# EAGLE design Trigger Chameleon (EAGLE 8.1.1)
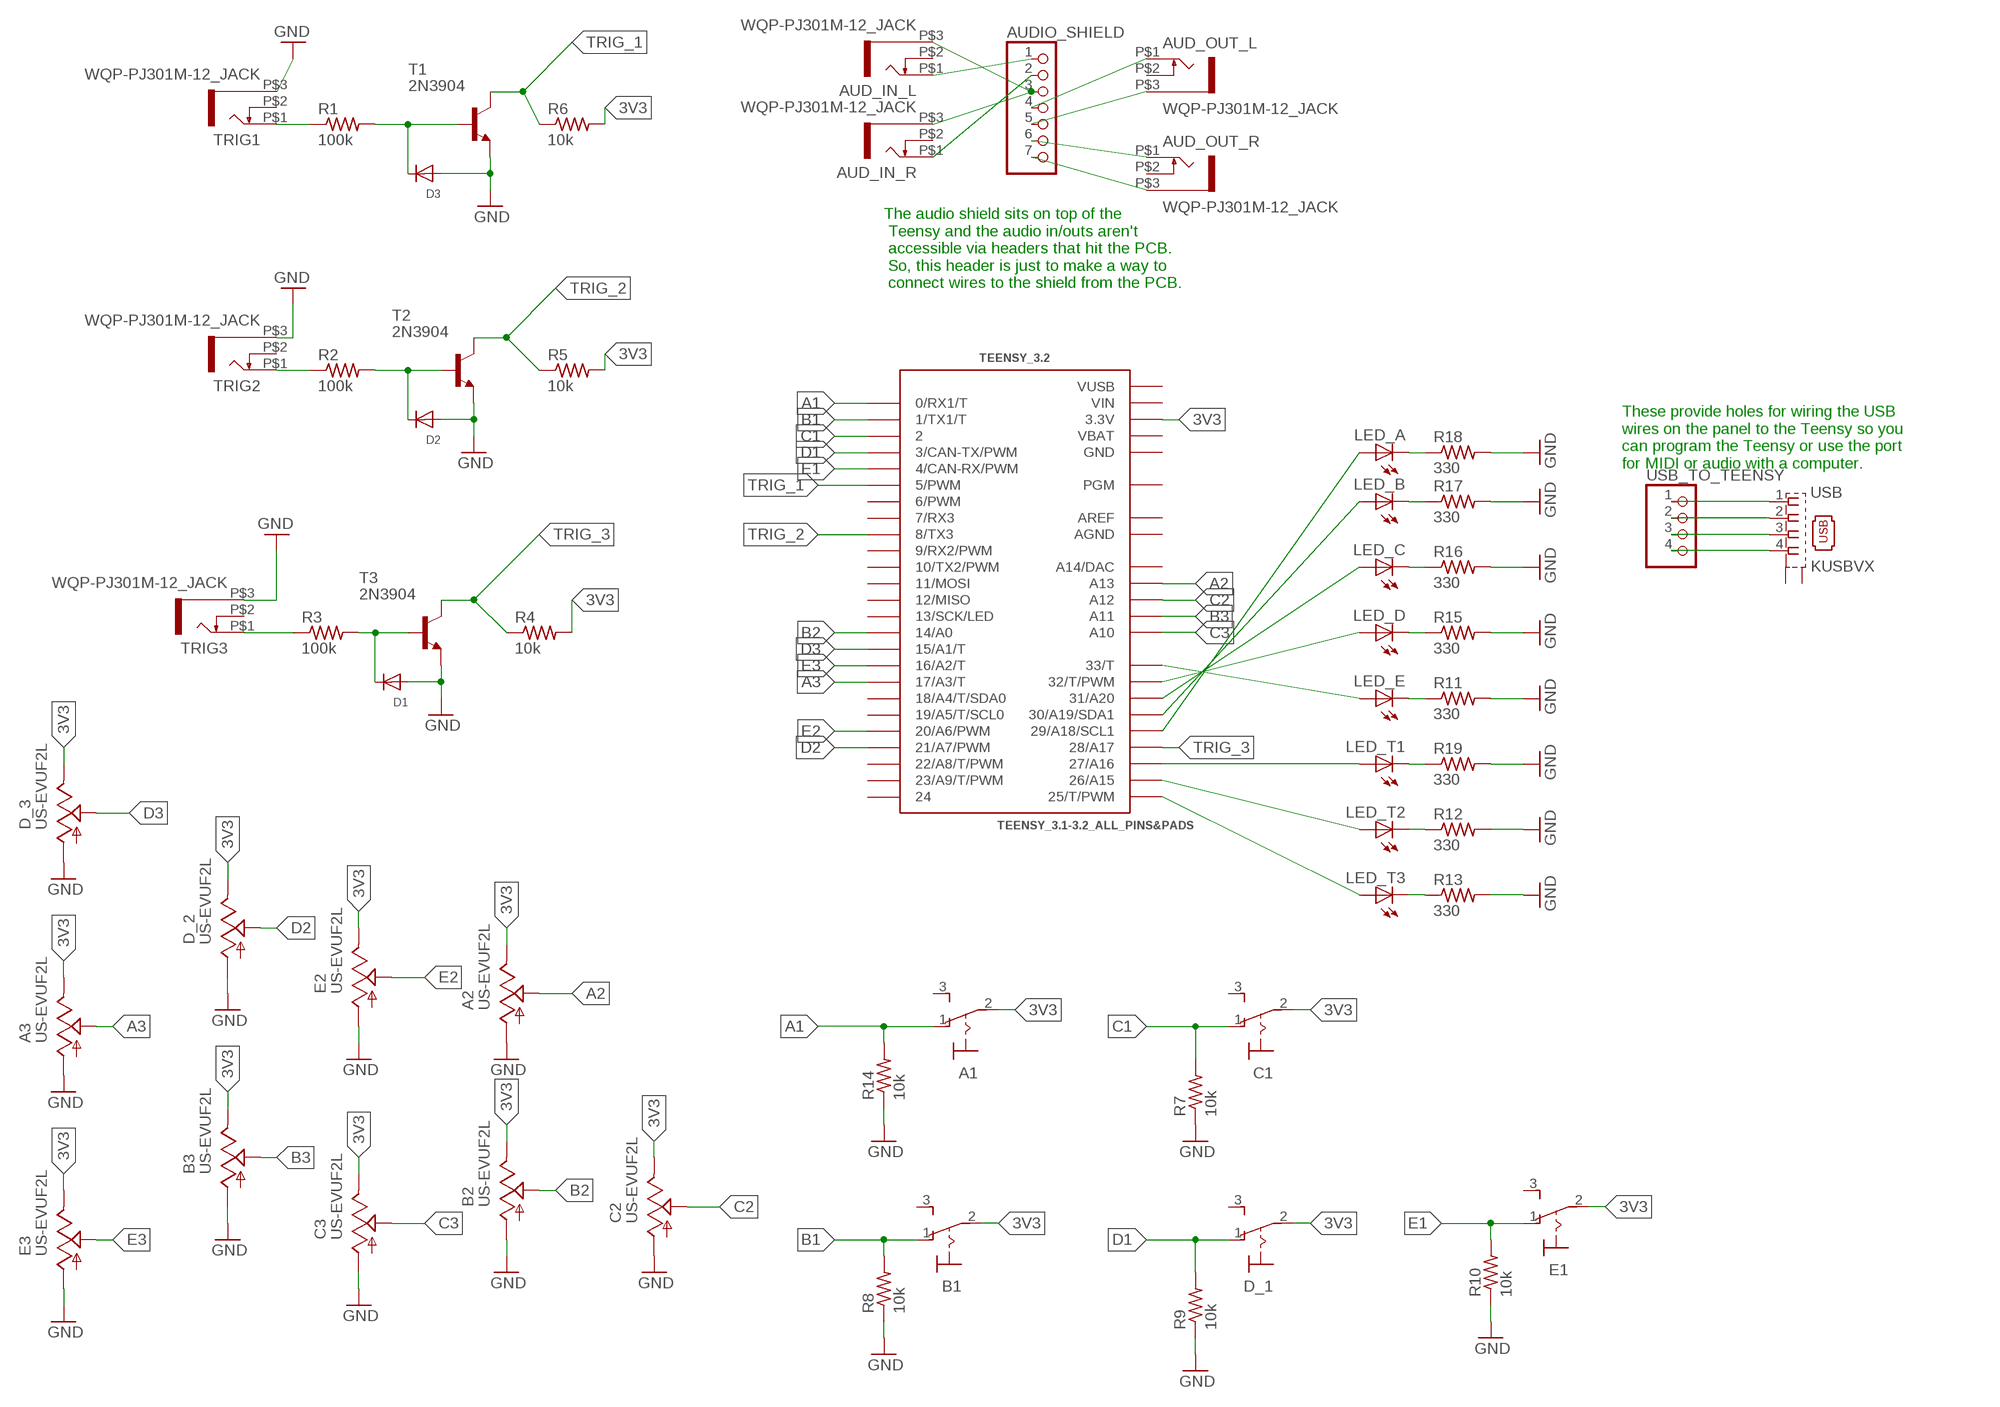
[diagram p0: schematic, sheet 1]

## Parts
A1  M9040P  [M9040P]
A2  US-EVUF2L  [EVUFXL]
A3  US-EVUF2L  [EVUFXL]
AUD_IN_L  WQP-PJ301M-12_JACK  [WQP-PJ301M-12_JACK]
AUD_IN_R  WQP-PJ301M-12_JACK  [WQP-PJ301M-12_JACK]
AUD_OUT_L  WQP-PJ301M-12_JACK  [WQP-PJ301M-12_JACK]
AUD_OUT_R  WQP-PJ301M-12_JACK  [WQP-PJ301M-12_JACK]
AUDIO_SHIELD  PINHD-1X7  [1X07]
B1  M9040P  [M9040P]
B2  US-EVUF2L  [EVUFXL]
B3  US-EVUF2L  [EVUFXL]
C1  M9040P  [M9040P]
C2  US-EVUF2L  [EVUFXL]
C3  US-EVUF2L  [EVUFXL]
D1  DIODESOD-123  [SOD-123]
D2  DIODESOD-123  [SOD-123]
D3  DIODESOD-123  [SOD-123]
D_1  M9040P  [M9040P]
D_2  US-EVUF2L  [EVUFXL]
D_3  US-EVUF2L  [EVUFXL]
E1  M9040P  [M9040P]
E2  US-EVUF2L  [EVUFXL]
E3  US-EVUF2L  [EVUFXL]
LED_A  LED3MM  [LED3MM]
LED_B  LED3MM  [LED3MM]
LED_C  LED3MM  [LED3MM]
LED_D  LED3MM  [LED3MM]
LED_E  LED3MM  [LED3MM]
LED_T1  LED3MM  [LED3MM]
LED_T2  LED3MM  [LED3MM]
LED_T3  LED3MM  [LED3MM]
R1  100k  R-US_R0805  [R0805]
R2  100k  R-US_R0805  [R0805]
R3  100k  R-US_R0805  [R0805]
R4  10k  R-US_R0805  [R0805]
R5  10k  R-US_R0805  [R0805]
R6  10k  R-US_R0805  [R0805]
R7  10k  R-US_R0805  [R0805]
R8  10k  R-US_R0805  [R0805]
R9  10k  R-US_R0805  [R0805]
R10  10k  R-US_R0805  [R0805]
R11  330  R-US_R0805  [R0805]
R12  330  R-US_R0805  [R0805]
R13  330  R-US_R0805  [R0805]
R14  10k  R-US_R0805  [R0805]
R15  330  R-US_R0805  [R0805]
R16  330  R-US_R0805  [R0805]
R17  330  R-US_R0805  [R0805]
R18  330  R-US_R0805  [R0805]
R19  330  R-US_R0805  [R0805]
T1  2N3904  [TO92]
T2  2N3904  [TO92]
T3  2N3904  [TO92]
TEENSY_3.2  TEENSY_3.1-3.2_ALL_PINS&PADS  [TEENSY_3.0-3.2_ALL_PINS_&_PADS]
TRIG1  WQP-PJ301M-12_JACK  [WQP-PJ301M-12_JACK]
TRIG2  WQP-PJ301M-12_JACK  [WQP-PJ301M-12_JACK]
TRIG3  WQP-PJ301M-12_JACK  [WQP-PJ301M-12_JACK]
USB  KUSBVX  [KUSBVX]
USB_TO_TEENSY  PINHD-1X4  [1X04]

## Nets
3V3: A1.2(P) A2.3(E) A3.3(E) B1.2(P) B2.3(E) B3.3(E) C1.2(P) C2.3(E) C3.3(E) D_1.2(P) D_2.3(E) D_3.3(E) E1.2(P) E2.3(E) E3.3(E) R4.2 R5.2 R6.2 TEENSY_3.2.3.3V TEENSY_3.2.3.3V1(3.3V) TEENSY_3.2.3.3V2(3.3V)
A1: A1.1(O) R14.2 TEENSY_3.2.0(0/RX1/T)
A2: A2.2(S) TEENSY_3.2.A13
A3: A3.2(S) TEENSY_3.2.17/A3(17/A3/T)
B1: B1.1(O) R8.2 TEENSY_3.2.1(1/TX1/T)
B2: B2.2(S) TEENSY_3.2.14/A0
B3: B3.2(S) TEENSY_3.2.A11
C1: C1.1(O) R7.2 TEENSY_3.2.2
C2: C2.2(S) TEENSY_3.2.A12
C3: C3.2(S) TEENSY_3.2.A10
D1: D_1.1(O) R9.2 TEENSY_3.2.3(3/CAN-TX/PWM)
D2: D_2.2(S) TEENSY_3.2.21/A7(21/A7/PWM)
D3: D_3.2(S) TEENSY_3.2.15/A1(15/A1/T)
E1: E1.1(O) R10.2 TEENSY_3.2.4(4/CAN-RX/PWM)
E2: E2.2(S) TEENSY_3.2.20/A6(20/A6/PWM)
E3: E3.2(S) TEENSY_3.2.16/A2(16/A2/T)
GND: A2.1(A) A3.1(A) B2.1(A) B3.1(A) C2.1(A) C3.1(A) D1.A D2.A D3.A D_2.1(A) D_3.1(A) E3.1(A) R7.1 R8.1 R9.1 R10.1 R11.2 R12.2 R13.2 R14.1 R15.2 R16.2 R17.2 R18.2 R19.2 T1.3(E) T2.3(E) T3.3(E) TRIG1.P$3 TRIG2.P$3 TRIG3.P$3
N$1: R3.1 TRIG3.P$1
N$2: R2.1 TRIG2.P$1
N$3: R1.1 TRIG1.P$1
N$4: D3.C R1.2 T1.2(B)
N$5: D2.C R2.2 T2.2(B)
N$6: D1.C R3.2 T3.2(B)
N$7: LED_D.K(C) R15.1
N$8: LED_C.K(C) R16.1
N$9: LED_B.K(C) R17.1
N$10: LED_A.K(C) R18.1
N$11: LED_E.K(C) R11.1
N$12: LED_T3.K(C) R13.1
N$13: LED_T2.K(C) R12.1
N$14: AUD_IN_L.P$1 AUDIO_SHIELD.1
N$15: AUD_IN_R.P$1 AUDIO_SHIELD.2
N$16: AUD_OUT_R.P$1 AUDIO_SHIELD.6
N$17: AUD_OUT_L.P$1 AUDIO_SHIELD.4
N$18: LED_T1.K(C) R19.1
N$19: LED_A.A TEENSY_3.2.29(29/A18/SCL1)
N$20: LED_B.A TEENSY_3.2.30(30/A19/SDA1)
N$21: LED_C.A TEENSY_3.2.31(31/A20)
N$22: LED_D.A TEENSY_3.2.32(32/T/PWM)
N$23: LED_E.A TEENSY_3.2.33(33/T)
N$28: AUD_OUT_R.P$3 AUDIO_SHIELD.7
N$30: AUD_OUT_L.P$3 AUDIO_SHIELD.5
N$31: AUD_IN_L.P$3 AUD_IN_R.P$3 AUDIO_SHIELD.3
N$32: LED_T1.A TEENSY_3.2.27(27/A16)
N$33: LED_T2.A TEENSY_3.2.26(26/A15)
N$34: LED_T3.A TEENSY_3.2.25(25/T/PWM)
N$38: USB.1 USB_TO_TEENSY.1
N$39: USB.2 USB_TO_TEENSY.2
N$40: USB.3 USB_TO_TEENSY.3
N$41: USB.4 USB_TO_TEENSY.4
TRIG_1: R6.1 T1.1(C) TEENSY_3.2.5(5/PWM)
TRIG_2: R5.1 T2.1(C) TEENSY_3.2.8(8/TX3)
TRIG_3: R4.1 T3.1(C) TEENSY_3.2.28(28/A17)
Unconnected: A1.3(S) AUD_IN_L.P$2 AUD_IN_R.P$2 AUD_OUT_L.P$2 AUD_OUT_R.P$2 B1.3(S) C1.3(S) D_1.3(S) E1.3(S) E2.1(A) TEENSY_3.2.6(6/PWM) TEENSY_3.2.7(7/RX3) TEENSY_3.2.9(9/RX2/PWM) TEENSY_3.2.10(10/TX2/PWM) TEENSY_3.2.11(11/MOSI) TEENSY_3.2.12(12/MISO) TEENSY_3.2.13(13/SCK/LED) TEENSY_3.2.18/A4(18/A4/T/SDA0) TEENSY_3.2.19/A5(19/A5/T/SCL0) TEENSY_3.2.22/A8(22/A8/T/PWM) TEENSY_3.2.23/A9(23/A9/T/PWM) TEENSY_3.2.24 TEENSY_3.2.PGM TEENSY_3.2.RESET/DAC(A14/DAC) TRIG1.P$2 TRIG2.P$2 TRIG3.P$2 USB.M1(S1) USB.M2(S2)

## Notes on the sheet
- The audio shield sits on top of the
   Teensy and the audio in/outs aren't
   accessible via headers that hit the PCB.
   So, this header is just to make a way to
   connect wires to the shield from the PCB.
- These provide holes for wiring the USB
  wires on the panel to the Teensy so you 
  can program the Teensy or use the port
  for MIDI or audio with a computer.

## Power pins joined to a net without a drawn wire
AGND: TEENSY_3.2.AGND
AREF: TEENSY_3.2.AREF
GND: TEENSY_3.2.GND TEENSY_3.2.GND1(GND) TEENSY_3.2.GND2(GND)
VBAT: TEENSY_3.2.VBAT
VIN: TEENSY_3.2.VIN
VUSB: TEENSY_3.2.VUSB

## Library data of the parts
A1 B1 C1 D_1 E1 = switch:M9040P: TOGGLE SWITCH Marquardt
A2 A3 B2 B3 C2 C3 D_2 D_3 E2 E3 = pot:US-EVU: 9 mm Square Rotary Potentiometers Source: Panasonic
AUD_IN_L AUD_IN_R AUD_OUT_L AUD_OUT_R TRIG1-TRIG3 = thonkiconn:WQP-PJ301M-12_JACK
AUDIO_SHIELD = pinhead:PINHD-1X7: PIN HEADER
D1-D3 = adafruit:DIODE: Diode SMADIODE - SMA Surface Mount Package 20V 1A Schottky Diode Digikey: 641-1014-6-ND DO-1N4148 - Through Hole Small Current Diode SOD-123 20V 1 A (.5mV Vf) Schottky Diode - Digikey: MBRX120TPMSCT-ND SOD-323 10V 570mA (.38mV Vf, 3ns) Schottky Diode - Digikey: ZLLS410CT-ND SOD-523 30V 30mA Schottky Diode (RB751S-40TE61) - Digikey: RB751S-40TE61CT-ND SOT23-R/W - SOT23 Package (R = Solder Paste/Reflow Ovens, W = Hand-Soldering) BAT54Film 40V 300mA - Digikey: 497-7162-1-ND
LED_A LED_B LED_C LED_D LED_E LED_T1-LED_T3 = adafruit:LED: LED OSRAM: - CHIPLED LG R971, LG N971, LY N971, LG Q971, LY Q971, LO R971, LY R971 LH N974, LH R974 LS Q976, LO Q976, LY Q976 LO Q996 - Hyper CHIPLED LW Q18S LB Q993, LB Q99A, LB R99A - SideLED LS A670, LO A670, LY A670, LG A670, LP A670 LB A673, LV A673, LT A673, LW A673 LH A674 LY A675 LS A676, LA A676, LO A676, LY A676, LW A676 LS A679, LY A679, LG A679 - Hyper Micro SIDELED® LS Y876, LA Y876, LO Y876, LY Y876 LT Y87S - SmartLED LW L88C, LW L88S LB L89C, LB L89S, LG L890 LS L89K, LO L89K, LY L89K LS L896, LA L896, LO L896, LY L896 - TOPLED LS T670, LO T670, LY T670, LG T670, LP T670 LSG T670, LSP T670, LSY T670, LOP T670, LYG T670 LG T671, LOG T671, LSG T671 LB T673, LV T673, LT T673, LW T673 LH T674 LS T676, LA T676, LO T676, LY T676, LB T676, LH T676, LSB T676, LW T676 LB T67C, LV T67C, LT T67C, LS T67K, LO T67K, LY T67K, LW E67C LS E67B, LA E67B, LO E67B, LY E67B, LB E67C, LV E67C, LT E67C LW T67C LS T679, LY T679, LG T679 LS T770, LO T770, LY T770, LG T770, LP T770 LB T773, LV T773, LT T773, LW T773 LH T774 LS E675, LA E675, LY E675, LS T675 LS T776, LA T776, LO T776, LY T776, LB T776 LHGB T686 LT T68C, LB T68C - Hyper Mini TOPLED® LB M676 - Mini TOPLED Santana® LG M470 LS M47K, LO M47K, LY M47K Source: http://www.osram.convergy.de/
R1-R19 = resistor:R-US_: RESISTOR, American symbol
T1-T3 = transistor:2N3904: NPN TRANSISTOR
TEENSY_3.2 = Teensy_3_and_LC_Series_Boards_v1.4:TEENSY_3.1-3.2_ALL_PINS&PADS: Footprint for Teensy 3.1 or 3.2 board using all pads and all through-holes. Pads need a 2x7 0.1" SMD header.
USB = con-kycon:KUSBVX: Vertical,Top Entry Universal Serial Bus Connector KUSBVX Series Source: KYCON Sibalco USB vertical socket KUSBV.pdf
USB_TO_TEENSY = pinhead:PINHD-1X4: PIN HEADER

## Board
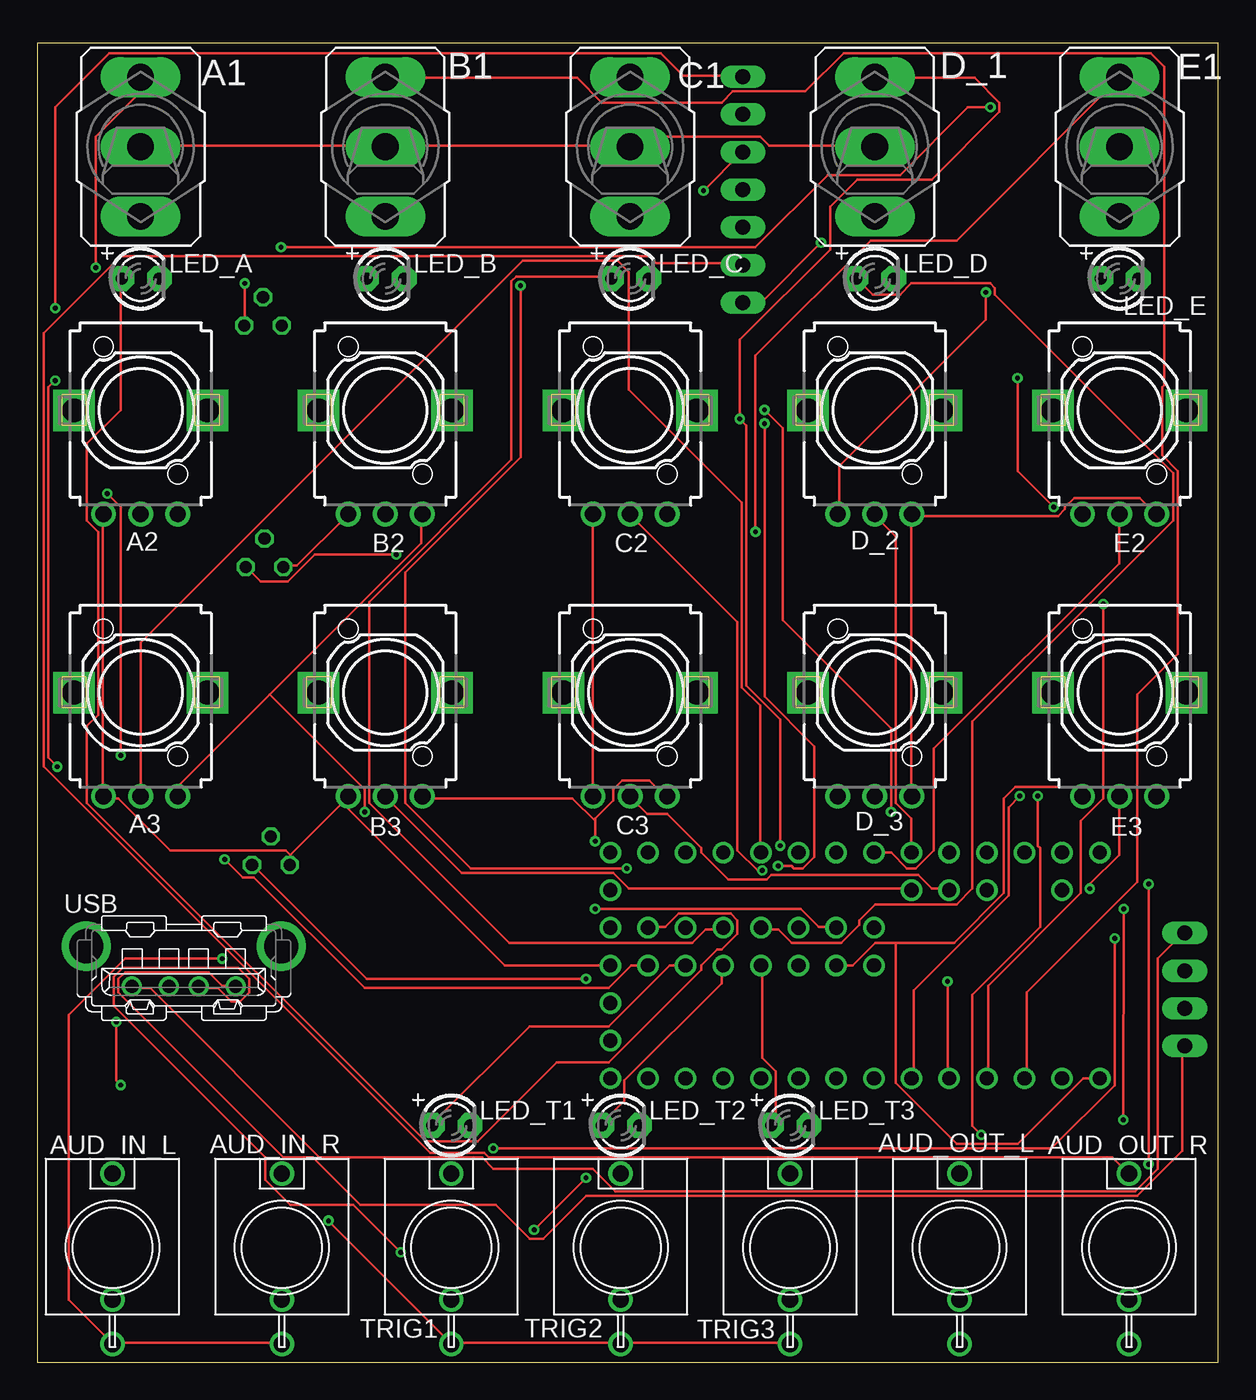
[diagram p1: board, top side]
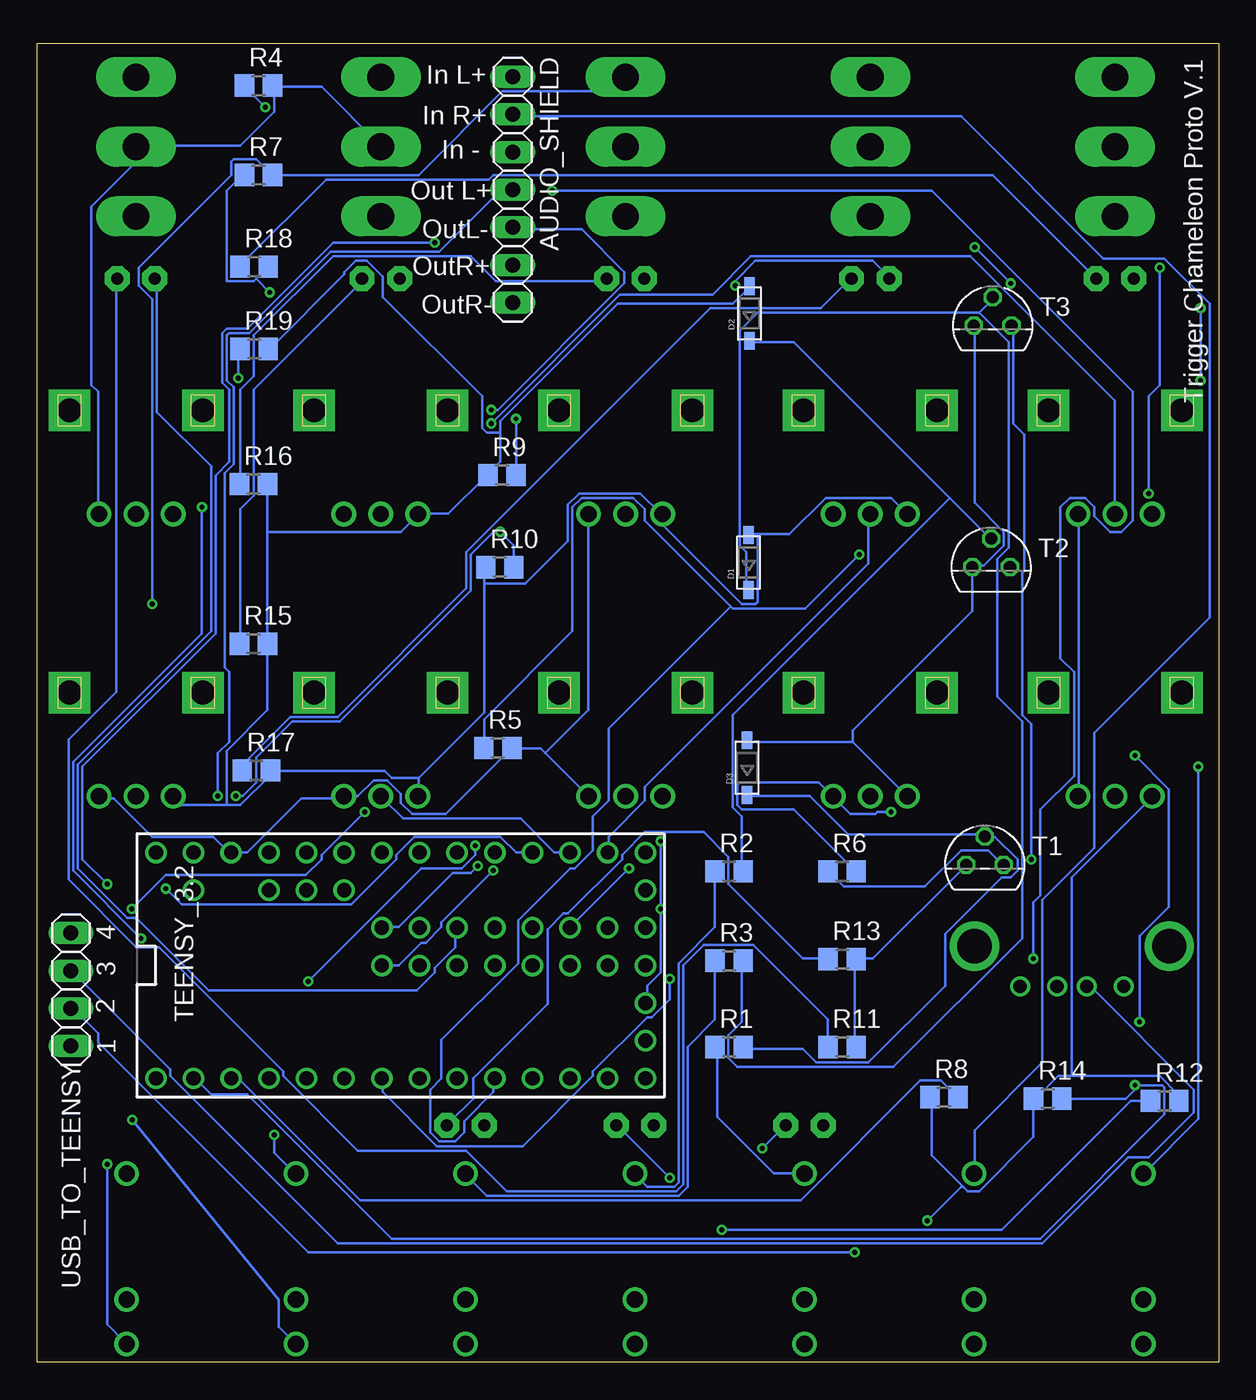
[diagram p2: board, bottom side, seen from below]

Size 79.68 x 89.01 mm. Coordinates in mm from the lower left corner, seen from the top.
Outline: 0,0 79.68,0 79.68,89.01 0,89.01 0,0
Copper layers (1*16): Top 0.0356mm / dielectric 1.5011mm / Bottom 0.0356mm
Design rules "oshpark-2layer *": minimum track width 6mil, minimum drill 13mil, track to track 6mil, track to pad 6mil, pad to pad 6mil, via to via 6mil, smd to smd 0mil, copper to edge 15mil, drill to drill 6mil, minimum pad ring 7mil, minimum via ring 7mil, stop-mask expansion 2.5mil, vias tented up to drill 0mil, thermal gap 10mil

### Footprints (pad centres in the part's own frame; a part is rotated, then mirrored left to right if it is on the bottom)
M9040P = drill 1.803 long: 1 0,4.699; 2 0,0; 3 0,-4.699
EVUFXL = drill 1.1 pad 1.676: 1 -2.5,-7; 2 0,-7; 3 2.5,-7 | drill 1.6 pad 2.8 square: M1 4.5,0; M2 -4.5,0
WQP-PJ301M-12_JACK = drill 1.1: P$1 0,5; P$2 0,-3.5; P$3 0,-6.5
1X07 = drill 1.016 long: 1 -7.62,0; 2 -5.08,0; 3 -2.54,0; 4 0,0; 5 2.54,0; 6 5.08,0; 7 7.62,0
SOD-123 = smd 1.2 x 0.7: A 1.85,0; C -1.85,0
LED3MM = drill 0.813 pad 1.676 octagon: A -1.27,0; K 1.27,0
R0805 = smd 1.3 x 1.5: 1 -0.95,0; 2 0.95,0
TO92 = drill 0.813 octagon: 1 1.27,0; 2 0,1.905; 3 -1.27,0
TEENSY_3.0-3.2_ALL_PINS_&_PADS = drill 0.965: 0 -7.62,13.97; 1 -7.62,11.43; 2 -7.62,8.89; 3 -7.62,6.35; 3.3V 7.62,11.43; 3.3V1 -2.54,-16.51; 3.3V2 2.54,-1.27; 4 -7.62,3.81; 5 -7.62,1.27; 6 -7.62,-1.27; 7 -7.62,-3.81; 8 -7.62,-6.35; 9 -7.62,-8.89; 10 -7.62,-11.43; 11 -7.62,-13.97; 12 -7.62,-16.51; 13 7.62,-16.51; 14/A0 7.62,-13.97; 15/A1 7.62,-11.43; 16/A2 7.62,-8.89; 17/A3 7.62,-6.35; 18/A4 7.62,-3.81; 19/A5 7.62,-1.27; 20/A6 7.62,1.27; 21/A7 7.62,3.81; 22/A8 7.62,6.35; 23/A9 7.62,8.89; 24 0,-3.81; 25 0,-6.35; 26 0,-8.89; 27 0,-11.43; 28 0,-13.97; 29 2.54,-13.97; 30 2.54,-11.43; 31 2.54,-8.89; 32 2.54,-6.35; 33 2.54,-3.81; A10 5.08,6.35; A11 5.08,3.81; A12 0,1.27; A13 2.54,1.27; AGND 7.62,13.97; AREF 5.08,8.89; GND -7.62,16.51; GND1 0,-16.51; GND2 0,-1.27; PGM 2.54,-16.51; RESET/DAC 5.08,-16.51; VBAT -5.08,-16.51; VIN 7.62,16.51; VUSB 5.08,13.97
KUSBVX = drill 0.9 pad 1.3: 1 3.5,0; 2 1,0; 3 -1,0; 4 -3.5,0 | drill 2.3 pad 2.8: M1 -6.57,2.71; M2 6.57,2.71
1X04 = drill 1.016 long: 1 -3.81,0; 2 -1.27,0; 3 1.27,0; 4 3.81,0

### Placement (x,y rotation side)
A1  6.99,82.04 0 top
A2  6.99,64.26 0 top
A3  6.99,45.21 0 top
AUD_IN_L  5.08,7.74 0 top
AUD_IN_R  16.51,7.74 0 top
AUD_OUT_L  62.23,7.74 0 top
AUD_OUT_R  73.66,7.74 0 top
AUDIO_SHIELD  47.61,79.14 270 bottom
B1  23.5,82.04 0 top
B2  23.5,64.26 0 top
B3  23.5,45.21 0 top
C1  40.01,82.04 0 top
C2  40.01,64.26 0 top
C3  40.01,45.21 0 top
D1  31.7,53.98 90 bottom
D2  31.65,70.79 90 bottom
D3  31.81,40.14 90 bottom
D_1  56.52,82.04 0 top
D_2  56.52,64.26 0 top
D_3  56.52,45.21 0 top
E1  73.03,82.04 0 top
E2  73.03,64.26 0 top
E3  73.03,45.21 0 top
LED_A  6.99,73.15 0 top
LED_B  23.5,73.15 0 top
LED_C  40.01,73.15 0 top
LED_D  56.52,73.15 0 top
LED_E  73.03,73.15 0 top
LED_T1  27.94,16 0 top
LED_T2  39.37,16 0 top
LED_T3  50.8,16 0 top
R1  33.02,21.29 0 bottom
R2  33.02,33.14 0 bottom
R3  33.02,27.11 0 bottom
R4  64.77,86.17 0 bottom
R5  48.63,41.47 0 bottom
R6  25.4,33.14 0 bottom
R7  64.77,80.13 0 bottom
R8  18.52,17.9 0 bottom
R9  48.34,59.87 0 bottom
R10  48.49,53.67 0 bottom
R11  25.4,21.29 0 bottom
R12  3.64,17.65 0 bottom
R13  25.4,27.22 0 bottom
R14  11.53,17.8 0 bottom
R15  65.11,48.5 0 bottom
R16  65.11,59.27 0 bottom
R17  64.91,39.95 0 bottom
R18  65.06,73.95 0 bottom
R19  65.06,68.4 0 bottom
T1  15.77,33.58 0 bottom
T2  15.34,53.69 0 bottom
T3  15.24,69.97 0 bottom
TEENSY_3.2  55.18,26.79 90 bottom
TRIG1  27.94,7.74 0 top
TRIG2  39.37,7.74 0 top
TRIG3  50.8,7.74 0 top
USB  9.9,25.38 0 top
USB_TO_TEENSY  77.42,25.17 90 bottom

### Tracks (layer width: path | path; a pad name or v marks a point on that pad's centre or on a via)
3V3  (via drill 0.33)
  Top 0.152: A1.2 7.01,82.11 23.47,82.11 B1.2 23.62,82.11 39.93,82.11 C1.2 40.69,82.72 48.77,82.72 49.38,82.11 56.39,82.11 D_1.2 | E2.3 75.44,57.27 74.37,58.34 69.95,58.34 69.34,57.73 69.34,57.58 68.89,57.12 59.13,57.12 D_2.3 58.98,57.12 58.98,38.22 D_3.3 | 15.7,45.08 9.6,38.98 9.6,38.22 A3.3 | 15.7,45.08 25.91,55.29 25.91,57.12 B2.3 | 37.64,36.55 37.64,36.7 38.86,37.92 38.86,38.68 39.47,39.29 41.3,39.29 42.37,38.22 C3.3 | 37.64,36.55 v37.64,35.17 | v37.64,30.6 51.51,30.6 52.73,29.38 53.8,29.38 TEENSY_3.2.3.3V2 | 37.64,36.55 36.12,38.07 26.06,38.07 B3.3 | 15.7,45.08 22.1,38.68 v22.1,37.15
  Bottom 0.152: 63.7,86.08 60.5,86.08 56.54,82.11 D_1.2 | 63.7,86.08 63.7,84.4 65.99,82.11 73,82.11 E1.2 73.15,81.96 73.15,80.89 76.05,78 76.05,65.96 75.59,65.5 75.59,57.27 E2.3 | 63.7,86.08 R4.2 | E3.3 75.44,38.07 74.52,38.07 71.93,35.48 67.82,35.48 66.75,34.41 TEENSY_3.2.3.3V 65.53,34.41 61.87,38.07 59.13,38.07 D_3.3 58.98,38.22 58.06,38.22 57,39.29 56.08,39.29 55.17,38.37 55.17,37.76 54.41,37 52.12,37 47.7,41.42 R5.2 47.55,41.42 45.72,41.42 45.41,41.12 | A3.3 9.45,38.22 9.45,57.12 A2.3 | R6.2 24.54,33.19 28.65,37.31 32.16,37.31 32.46,37.61 32.46,38.98 32.31,39.14 26.98,39.14 26.06,38.22 B3.3 25.91,38.07 24.84,37 23.16,37 23.01,37.15 v22.1,37.15 | 45.41,41.12 C3.3 | v37.64,35.17 v37.64,30.6 37.64,26.33 38.56,25.42 38.56,24.35 TEENSY_3.2.3.3V1 | 45.41,41.12 42.52,44.01 42.52,57.12 C2.3
A1  (via drill 0.33)
  Top 0.152: v3.96,73.88 3.96,82.72 6.86,85.62 6.86,86.68 A1.1 | v4.72,58.64 5.64,57.73 v5.64,40.96 | v5.33,22.98 5.33,19.02 v5.64,18.71
  Bottom 0.152: R14.2 6.25,17.8 5.49,18.56 | 5.49,18.56 5.33,18.71 3.81,18.71 3.66,18.56 3.66,16.73 12.04,8.35 55.78,8.35 65.53,18.1 67.97,18.1 69.04,19.17 TEENSY_3.2.0 | v3.96,73.88 3.96,65.96 4.72,65.2 v4.72,58.64 | v5.64,40.96 3.35,38.68 3.35,30.75 5.33,28.77 v5.33,22.98 | 5.49,18.56 v5.64,18.71
A2  (via drill 0.33)
  Top 0.152: v49.99,33.5 50.9,33.5 51.05,33.34 51.66,33.34 52.43,34.11 52.43,41.57 49.07,44.93 v49.07,63.37
  Bottom 0.152: v49.99,33.5 50.44,33.04 51.66,33.04 55.32,29.38 56.39,29.38 TEENSY_3.2.A13 | v49.07,63.37 40.39,72.05 34.14,72.05 31.55,74.65 16.76,74.65 7.01,64.89 7.01,57.27 A2.2
A3
  Top 0.152: TEENSY_3.2.17/A3 48.77,34.41 48.77,44.32 47.55,45.54 47.55,58.03 39.93,65.65 39.93,73.58 39.17,74.34 32.77,74.34 7.01,48.58 7.01,38.22 A3.2
B1
  Top 0.152: B1.1 23.62,86.68 36.42,86.68 38.1,85.01 46.18,85.01 46.94,85.77 51.82,85.77 54.41,88.36 75.13,88.36 76.05,87.45 76.05,65.96 75.89,65.81 75.89,61.23 76.96,60.17 76.96,47.82 74.22,45.08 74.22,32.43 66.75,24.96 66.75,19.17 TEENSY_3.2.1
  Bottom 0.152: TEENSY_3.2.1 66.14,19.17 57.91,10.94 28.19,10.94 20.12,19.02 18.75,19.02 17.68,17.95 R8.2
B2
  Bottom 0.152: TEENSY_3.2.14/A0 41.15,34.41 41.15,35.48 38.71,37.92 38.71,38.83 23.62,53.92 23.62,57.12 B2.2
B3
  Top 0.152: TEENSY_3.2.A11 58.98,31.97 39.93,31.97 38.86,33.04 28.65,33.04 23.62,38.07 B3.2
C1  (via drill 0.33)
  Top 0.152: v71.93,51.18 71.93,38.07 70.41,36.55 70.41,31.67 64.16,25.42 64.16,19.17 TEENSY_3.2.2
  Bottom 0.152: C1.1 40.08,86.68 41,85.77 48.31,85.77 53.95,80.13 R7.2 63.86,80.13 64.92,81.2 66.45,81.2 66.6,81.05 66.6,80.13 72.85,73.88 72.85,72.66 71.93,71.75 v71.93,51.18
C2  (via drill 0.33)
  Top 0.152: v48.92,33.19 48.62,33.19 47.24,34.56 47.24,49.96 40.08,57.12 C2.2
  Bottom 0.152: TEENSY_3.2.A12 55.32,26.79 53.8,28.32 53.49,28.32 52.43,29.38 52.43,29.69 v48.92,33.19
C3
  Top 0.152: TEENSY_3.2.A10 61.42,31.97 60.35,31.97 59.44,32.89 49.53,32.89 49.23,32.58 46.63,32.58 44.81,34.41 44.81,34.72 42.52,37 41.15,37 40.08,38.07 C3.2
D1  (via drill 0.33)
  Top 0.152: D_1.1 56.54,86.68 63.25,86.68 64.92,85.01 64.92,84.4 60.35,79.83 55.32,79.83 53.49,78 53.49,75.1 47.4,69.01 v47.4,63.67 47.85,63.22 47.85,45.69 50.14,43.4 v50.14,34.87 | v61.42,25.72 61.42,19.17 TEENSY_3.2.3
  Bottom 0.152: v47.4,63.67 47.4,60.01 R9.2 | v61.42,25.72 53.8,33.34 51.05,33.34 50.14,34.26 v50.14,34.87
D2
  Top 0.152: TEENSY_3.2.21/A7 58.98,34.41 58.98,36.7 57.91,37.76 57.91,55.75 56.54,57.12 D_2.2
D3
  Bottom 0.152: TEENSY_3.2.15/A1 44.81,34.41 47.09,36.7 55.02,36.7 56.39,38.07 D_3.2
E1  (via drill 0.33)
  Top 0.152: v48.46,56.05 48.46,67.94 56.24,75.71 62.03,75.71 73,86.68 E1.1 | v66.29,38.22 65.53,37.46 65.53,31.52 59.13,25.12 59.13,19.17 TEENSY_3.2.4
  Bottom 0.152: R10.2 47.55,53.77 47.55,55.14 v48.46,56.05 48.92,56.05 50.44,54.53 50.44,52.09 59.28,43.25 62.48,43.25 64.92,40.81 64.92,39.14 65.84,38.22 v66.29,38.22
E2
  Top 0.152: TEENSY_3.2.20/A6 57.61,34.41 58.67,33.34 59.28,33.34 60.5,34.56 60.5,41.42 73,53.92 73,57.12 E2.2
E3  (via drill 0.33)
  Top 0.152: v71.02,31.97 71.02,32.28 73,34.26 73,38.07 E3.2
  Bottom 0.152: TEENSY_3.2.16/A2 47.4,34.41 48.46,35.48 54.25,35.48 55.47,34.26 55.47,33.95 58.52,30.91 69.95,30.91 v71.02,31.97
GND  (via drill 0.33)
  Top 0.152: TEENSY_3.2.GND2 55.02,26.79 56.54,28.32 57.91,28.32 | 57.91,28.32 61.87,28.32 65.23,31.67 65.23,38.07 65.99,38.83 69.8,38.83 70.41,38.22 E3.1 | TEENSY_3.2.GND 70.56,19.17 66.14,14.75 62.03,14.75 57.91,18.87 57.91,28.32 | v64.01,72.21 64.01,70.38 54.1,60.47 54.1,57.27 D_2.1 | C3.1 37.49,38.22 37.49,57.12 C2.1 | T2.3 16.61,53.77 17.53,53.77 20.88,57.12 B2.1 | TRIG3.P$3 50.75,1.34 39.47,1.34 TRIG2.P$3 39.32,1.34 28.04,1.34 TRIG1.P$3 27.89,1.34 v19.66,9.57 | 17.07,34.26 17.07,33.65 T1.3 | 20.57,37.76 20.88,38.07 B3.1 20.57,37.76 | 20.57,37.76 17.07,34.26 | TEENSY_3.2.GND1 31.55,26.79 20.57,37.76 | 17.07,34.26 16.76,34.56 8.99,34.56 5.49,38.07 4.57,38.07 A3.1 4.42,38.22 4.42,57.12 A2.1
  Bottom 0.152: 49.53,52.55 49.53,43.86 53.95,39.44 | 49.53,52.55 49.53,53.61 R10.1 | 53.95,39.44 53.95,38.22 D_3.1 | 66.9,37.61 69.95,37.61 70.41,38.07 E3.1 | 66.9,37.61 65.99,37.61 64.01,39.59 64.01,39.9 R17.2 63.86,39.9 56.24,39.9 55.78,39.44 53.95,39.44 | 64.16,56.05 64.16,59.25 R16.2 | 64.16,56.05 64.16,48.58 R15.2 64.16,48.43 64.16,44.01 66.9,41.27 66.9,37.61 | 64.92,73.12 65.08,72.97 66.9,72.97 66.9,79.06 65.84,80.13 R7.1 | 64.92,73.12 64.16,73.88 R18.2 | 48.46,62.76 48.46,60.78 49.23,60.01 R9.1 49.38,59.86 51.97,57.27 53.95,57.27 D_2.1 54.1,57.12 55.17,56.05 64.16,56.05 | 48.46,62.76 48.46,63.52 40.54,71.44 32.77,71.44 31.7,72.51 D2.A | 48.46,62.76 49.38,62.76 49.68,63.06 49.68,65.2 56.39,71.9 56.39,73.27 57.45,74.34 58.22,74.34 58.98,73.58 58.98,73.43 64.01,68.4 R19.2 | v64.01,72.21 64.92,73.12 | 31.09,55.9 28.96,55.9 26.52,58.34 22.1,58.34 21.03,57.27 B2.1 | 31.09,55.9 31.7,55.9 D1.A | T3.3 16.46,69.92 16.46,58.03 14.48,56.05 14.48,55.14 15.85,53.77 16.61,53.77 T2.3 16.61,50.72 24.69,42.64 24.69,41.88 | 31.09,55.9 31.09,51.33 31.24,51.18 32.16,51.18 37.49,56.51 37.49,57.12 C2.1 37.64,57.27 39.01,58.64 43.13,58.64 43.89,57.88 43.89,55.44 46.79,52.55 49.53,52.55 | 9.91,19.32 10.82,19.32 12.34,17.8 R14.1 12.5,17.8 12.5,15.21 16.15,11.55 16.92,11.55 17.22,11.86 | 9.91,19.32 3.96,19.32 2.74,18.1 2.74,17.65 R12.2 | 17.22,11.86 19.36,13.99 19.36,17.8 R8.1 | R11.2 24.54,21.31 24.54,27.1 R13.2 24.38,27.25 23.32,27.25 17.07,33.5 T1.3 | 24.69,41.88 31.7,41.88 D3.A | 24.69,41.88 21.03,38.22 B3.1 | 9.91,19.32 9.91,32.74 4.57,38.07 A3.1 | v19.66,9.57 17.37,11.86 17.22,11.86
N$1
  Bottom 0.152: R3.1 33.98,27.1 33.98,23.13 35.81,21.31 35.81,11.86 36.42,11.25 49.38,11.25 50.75,12.62 TRIG3.P$1
N$2
  Bottom 0.152: R2.1 33.98,33.04 33.98,29.38 36.42,26.94 36.42,12.16 36.73,11.86 38.56,11.86 39.32,12.62 TRIG2.P$1
N$3
  Bottom 0.152: R1.1 33.83,21.15 33.83,16.58 30.02,12.77 28.04,12.77 TRIG1.P$1
N$4
  Bottom 0.152: D3.C 31.7,38.22 27.58,38.22 24.99,35.63 15.85,35.63 T1.2 15.7,35.48 15.09,35.48 13.56,33.95 13.56,33.19 14.02,32.74 14.63,32.74 18.44,28.93 18.44,25.42 23.62,20.24 27.13,20.24 28.04,21.15 32,21.15 R1.2
N$5
  Bottom 0.152: 18.14,58.34 15.39,55.6 T2.2 | 18.14,58.34 28.65,68.85 31.55,68.85 D2.C | 18.14,58.34 32.77,43.71 32.77,37.46 32.16,36.85 32.16,33.19 R2.2
N$6
  Bottom 0.152: 16.15,70.84 31.09,70.84 32.31,69.62 32.31,55.14 31.85,54.68 31.85,52.24 D1.C | 16.15,70.84 15.24,71.75 T3.2 | 16.15,70.84 14.17,68.85 14.17,54.99 14.94,54.22 14.94,44.93 13.26,43.25 13.26,28.62 21.95,19.93 32.46,19.93 33.07,20.54 33.07,22.07 32.16,22.98 32.16,27.1 R3.2
N$7
  Bottom 0.152: R15.1 65.99,48.58 65.99,57.58 65.08,58.49 65.08,65.65 57.91,72.82 57.91,73.12 LED_D.K
N$8
  Bottom 0.152: LED_C.K 41.45,72.97 48.77,72.97 50.44,74.65 59.74,74.65 65.08,69.31 65.08,66.57 65.99,65.65 65.99,59.41 R16.1
N$9
  Bottom 0.152: R17.1 65.84,40.05 65.84,40.36 62.64,43.56 59.44,43.56 50.75,52.24 50.75,54.68 34.29,71.14 26.82,71.14 24.84,73.12 LED_B.K
N$10
  Bottom 0.152: LED_A.K 15.24,80.13 48.92,80.13 49.23,79.83 60.2,79.83 65.99,74.04 R18.1
N$11
  Bottom 0.152: R11.1 26.36,21.31 26.36,23.13 31.39,28.16 34.75,28.16 36.12,26.79 36.12,12.01 36.58,11.55 48.01,11.55 50.75,14.29 58.06,14.29 63.09,19.32 63.09,19.63 71.48,28.01 73,28.01 77.57,32.58 77.57,42.03 74.37,45.23 74.37,73.12 LED_E.K
N$12
  Bottom 0.152: R13.1 26.36,27.25 28.04,27.25 33.07,32.28 33.07,34.11 34.75,35.78 38.71,35.78 40.23,34.26 40.23,33.95 43.89,30.3 44.2,30.3 45.26,29.23 45.26,24.2 50.29,19.17 50.29,17.8 51.97,16.12 LED_T3.K
N$13  (via drill 0.33)
  Top 0.152: v37.03,12.47 v33.53,8.96
  Bottom 0.152: R12.1 5.94,17.65 14.63,8.96 v33.53,8.96 | v37.03,12.47 40.54,15.97 LED_T2.K
N$14  (via drill 0.33)
  Top 0.152: v1.22,71.14 1.22,84.7 4.88,88.36 42.06,88.36 43.59,86.84 47.55,86.84 AUDIO_SHIELD.1 | v1.22,66.26 0.76,65.81 0.76,40.81 v1.37,40.2
  Bottom 0.152: v1.22,66.26 v1.22,71.14 | v1.37,40.2 1.37,16.43 5.03,12.77 AUD_IN_L.P$1
N$15
  Bottom 0.152: AUDIO_SHIELD.2 47.55,84.09 17.37,84.09 7.77,74.49 3.66,74.49 0.61,71.44 0.61,50.26 8.38,42.49 8.38,34.72 11.89,31.21 11.89,20.24 16.46,15.67 16.46,12.77 AUD_IN_R.P$1
N$16
  Top 0.152: AUDIO_SHIELD.6 47.55,74.19 41.76,74.19 41.3,74.65 5.64,74.65 0.46,69.46 0.46,40.2 26.52,14.14 30.18,14.14 30.48,13.84 72.54,13.84 73.61,12.77 AUD_OUT_R.P$1
N$17  (via drill 0.33)
  Top 0.152: v67.51,38.22 67.51,34.87 67.67,34.72 67.67,29.38 63.09,24.81 63.09,15.97 v63.7,15.36
  Bottom 0.152: v67.51,38.22 67.51,41.12 66.75,41.88 66.75,46.6 67.06,46.91 67.06,60.01 66.45,60.62 66.45,65.81 66.9,66.26 66.9,69.31 66.75,69.46 65.38,69.46 59.89,74.95 52.58,74.95 48.46,79.06 47.7,79.06 AUDIO_SHIELD.4 | v63.7,15.36 63.7,14.14 62.33,12.77 AUD_OUT_L.P$1
N$18  (via drill 0.33)
  Top 0.152: v66.14,66.42 66.14,60.17 v68.58,57.73 | v72.69,28.62 72.69,18.71 68.43,14.45 v30.79,14.45
  Bottom 0.152: v66.14,66.42 66.14,68.4 R19.1 | v68.58,57.73 68.58,49.19 77.27,40.51 77.27,33.19 v72.69,28.62 | v30.79,14.45 29.26,15.97 LED_T1.K
N$19
  Top 0.152: TEENSY_3.2.29 41.3,29.38 42.37,29.38 43.28,30.3 46.79,30.3 47.24,29.84 47.24,28.93 46.18,27.86 45.87,27.86 44.81,26.79 44.81,26.49 38.56,20.24 35.05,20.24 29.72,14.9 26.21,14.9 3.35,37.76 3.35,42.95 4.12,43.71 4.12,56.05 3.35,56.81 3.35,62 5.64,64.28 5.64,73.12 LED_A.A
N$20  (via drill 0.33)
  Top 0.152: v39.78,33.34 29.26,33.34 24.84,37.76 24.84,53.31 32.61,61.08 v32.61,72.66
  Bottom 0.152: v39.78,33.34 43.74,29.38 TEENSY_3.2.30 | v32.61,72.66 32.61,72.97 31.24,74.34 23.32,74.34 22.25,73.27 LED_B.A
N$21
  Top 0.152: TEENSY_3.2.31 46.18,29.23 45.11,29.23 44.2,28.32 31.85,28.32 22.4,37.76 22.4,51.33 32,60.93 32,72.97 32.31,73.27 38.71,73.27 LED_C.A
N$22
  Top 0.152: TEENSY_3.2.32 48.92,29.23 49.99,29.23 50.9,28.32 54.25,28.32 55.47,29.53 55.47,29.84 56.54,30.91 62.03,30.91 63.09,31.97 63.09,43.25 76.66,56.81 76.66,60.01 64.62,72.05 64.62,72.51 64.31,72.82 58.98,72.82 58.22,72.05 56.39,72.05 55.32,73.12 LED_D.A
N$23
  Bottom 0.152: TEENSY_3.2.33 51.51,29.23 51.51,28.01 52.88,26.64 52.88,26.33 54.1,25.12 68.12,25.12 73,29.99 73.61,29.99 76.96,33.34 76.96,40.36 67.97,49.35 67.97,60.47 71.63,64.13 71.63,73.12 LED_E.A
N$28  (via drill 0.33)
  Top 0.152: v52.88,75.56 48.92,71.6 47.7,71.6 AUDIO_SHIELD.7 | v74.98,13.38 v74.98,32.28
  Bottom 0.152: v52.88,75.56 59.74,75.56 65.53,69.77 66.9,69.77 67.21,69.46 67.21,66.11 66.75,65.65 66.75,60.78 67.67,59.86 67.67,49.19 76.66,40.2 76.66,33.95 v74.98,32.28 | v74.98,13.38 74.98,2.56 73.76,1.34 AUD_OUT_R.P$3
N$30  (via drill 0.33)
  Top 0.152: v49.07,64.28 50.29,63.06 50.29,50.11 57.61,42.79 v57.61,37.15 | v73.27,16.38 v73.3,30.6
  Bottom 0.152: v49.07,64.28 48.62,64.28 40.08,72.82 40.08,73.58 42.98,76.47 47.55,76.47 AUDIO_SHIELD.5 | v57.61,37.15 60.5,34.26 60.5,33.95 61.57,32.89 71.02,32.89 v73.3,30.6 | v73.27,16.38 63.4,4.24 63.4,2.41 62.33,1.34 AUD_OUT_L.P$3
N$31  (via drill 0.33)
  Top 0.152: v44.96,79.06 47.55,81.66 AUDIO_SHIELD.3 | v12.5,27.25 5.94,27.25 2.13,23.44 2.13,4.24 5.03,1.34 AUD_IN_L.P$3 5.18,1.34 16.46,1.34 AUD_IN_R.P$3
  Bottom 0.152: v44.96,79.06 19.36,79.06 5.79,65.5 5.79,56.81 6.55,56.05 7.32,56.05 8.38,57.12 8.38,57.73 8.99,58.34 10.06,58.34 10.67,57.73 10.67,47.52 9.75,46.6 9.75,39.59 12.04,37.31 12.04,31.52 12.5,31.06 v12.5,27.25
N$32
  Top 0.152: TEENSY_3.2.27 42.67,26.79 38.56,22.68 33.22,22.68 26.67,16.12 LED_T1.A
N$33
  Top 0.152: TEENSY_3.2.26 46.18,26.79 46.18,25.57 39.62,19.02 39.62,17.65 38.1,16.12 LED_T2.A
N$34
  Top 0.152: TEENSY_3.2.25 48.92,26.79 48.92,20.54 49.84,19.63 49.84,16.43 49.53,16.12 LED_T3.A
N$38
  Top 0.152: USB.1 13.26,25.42 12.5,25.42 11.58,26.33 5.94,26.33 5.49,25.88 5.49,24.96 16.61,13.84 18.59,13.84 21.79,10.64 30.94,10.64 33.22,8.35 34.14,8.35 37.03,11.25 74.22,11.25 77.27,14.29 77.27,21.31 USB_TO_TEENSY.1
N$39  (via drill 0.33)
  Top 0.152: v24.54,7.44 21.34,10.64 17.07,10.64 15.39,12.31 15.39,13.84 5.18,24.05 5.18,26.03 5.79,26.64 13.56,26.64 14.33,25.88 14.33,24.96 13.72,24.35 13.11,24.35 12.19,25.27 10.97,25.27 USB.2
  Bottom 0.152: v24.54,7.44 61.42,7.44 75.59,21.61 75.59,22.22 77.27,23.9 USB_TO_TEENSY.2
N$40
  Bottom 0.152: USB.3 8.84,25.27 8.53,25.27 1.68,18.41 1.68,16.89 4.72,13.84 6.1,13.84 11.89,8.05 59.44,8.05 70.71,19.32 70.71,19.78 77.27,26.33 USB_TO_TEENSY.3
N$41
  Top 0.152: USB.4 6.4,25.27 7.62,25.27 19.05,13.84 30.02,13.84 30.79,13.08 37.49,13.08 39.01,11.55 74.07,11.55 75.59,13.08 75.59,27.25 77.27,28.93 USB_TO_TEENSY.4
TRIG_1  (via drill 0.33)
  Top 0.152: v37.03,25.88 22.25,25.88 14.63,33.5 T1.1
  Bottom 0.152: R6.1 26.21,33.04 25.3,32.13 19.81,32.13 17.37,34.56 15.54,34.56 14.63,33.65 T1.1 | v37.03,25.88 37.03,24.51 38.25,23.29 38.56,23.29 42.22,19.63 42.22,19.32 46.94,14.6 52.73,14.6 56.39,18.26 56.39,19.17 TEENSY_3.2.5
TRIG_2  (via drill 0.33)
  Top 0.152: v24.23,54.53 18.75,54.53 16.92,52.7 15.09,52.7 14.17,53.61 T2.1
  Bottom 0.152: 32.92,51.02 32.77,50.87 27.89,50.87 v24.23,54.53 | 32.92,51.02 38.71,56.81 38.71,57.58 39.47,58.34 42.98,58.34 43.59,57.73 43.59,49.35 49.53,43.4 49.53,41.57 R5.1 | 32.92,51.02 41.15,42.79 41.15,37.92 42.22,36.85 42.22,34.56 43.43,33.34 43.74,33.34 47.24,29.84 47.24,26.94 52.43,21.76 52.43,19.17 53.19,18.41 53.19,15.51 52.58,14.9 51.51,14.9 50.9,15.51 50.9,16.28 48.92,18.26 48.92,19.17 TEENSY_3.2.8
TRIG_3  (via drill 0.33)
  Top 0.152: v64.31,84.7 62.79,84.7 58.22,80.13 53.34,80.13 48.46,75.25 v16.46,75.25 | v14.02,72.82 14.02,70.07 T3.1 | TEENSY_3.2.28 40.08,26.79 38.56,25.27 22.1,25.27 14.63,32.74 13.87,32.74 v12.65,33.95
  Bottom 0.152: v64.31,84.7 65.68,86.08 R4.1 | v14.02,72.82 v16.46,75.25 | v12.65,33.95 12.65,43.1 13.26,43.71 13.26,53.31 13.11,53.46 13.11,62.61 13.87,63.37 13.87,69.92 T3.1

### Text on the board
bNames: Trigger Chameleon Proto V.1 | In L+ | In R+ | In - | Out L+ | OutL- | OutR+ | OutR- | 4 | 3 | 2 | 1